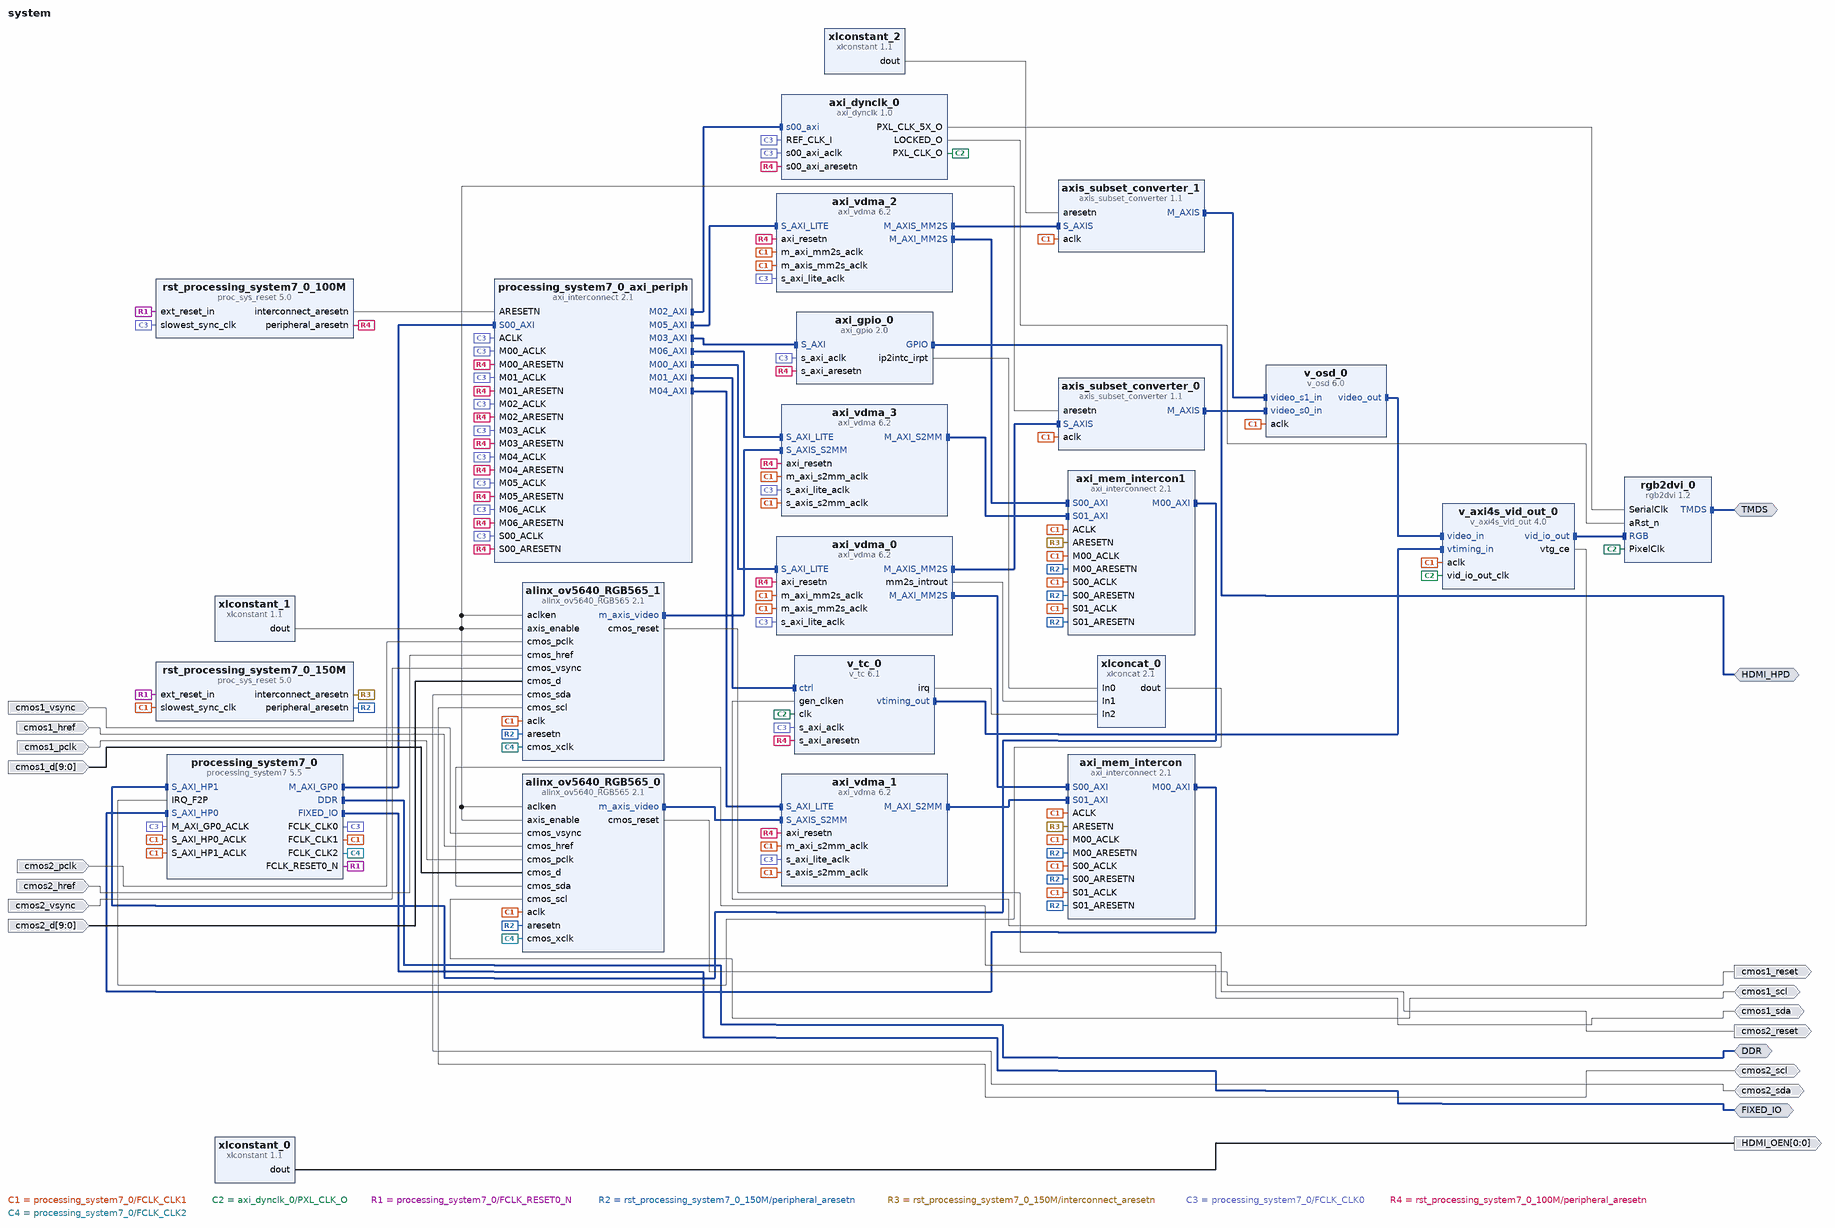
[diagram p0: block diagram of the top level]
# Vivado block design system, Vivado 2015.4
create_bd_design system

create_bd_intf_port -mode Master -vlnv digilentinc.com:interface:tmds_rtl:1.0 TMDS
create_bd_intf_port -mode Master -vlnv xilinx.com:interface:gpio_rtl:1.0 HDMI_HPD
create_bd_intf_port -mode Master -vlnv xilinx.com:interface:ddrx_rtl:1.0 DDR
create_bd_intf_port -mode Master -vlnv xilinx.com:display_processing_system7:fixedio_rtl:1.0 FIXED_IO
create_bd_port -dir O -from 0 -to 0 HDMI_OEN
create_bd_port -dir IO cmos2_sda
create_bd_port -dir IO cmos2_scl
create_bd_port -dir O cmos2_reset
create_bd_port -dir I cmos2_pclk
create_bd_port -dir I cmos2_href
create_bd_port -dir I cmos2_vsync
create_bd_port -dir I -from 9 -to 0 cmos2_d
create_bd_port -dir I cmos1_vsync
create_bd_port -dir I cmos1_href
create_bd_port -dir I cmos1_pclk
create_bd_port -dir I -from 9 -to 0 cmos1_d
create_bd_port -dir IO cmos1_sda
create_bd_port -dir IO cmos1_scl
create_bd_port -dir O cmos1_reset

create_bd_cell -type ip -vlnv digilentinc.com:ip:axi_dynclk:1.0 axi_dynclk_0
create_bd_cell -type ip -vlnv xilinx.com:ip:axi_gpio:2.0 axi_gpio_0
set_property -dict {CONFIG.C_GPIO_WIDTH 1 CONFIG.C_ALL_INPUTS 1 CONFIG.C_INTERRUPT_PRESENT 1} [get_bd_cells axi_gpio_0]
create_bd_cell -type ip -vlnv xilinx.com:ip:axi_interconnect:2.1 axi_mem_intercon
set_property -dict {CONFIG.NUM_SI 2 CONFIG.NUM_MI 1} [get_bd_cells axi_mem_intercon]
create_bd_cell -type ip -vlnv xilinx.com:ip:axi_interconnect:2.1 axi_mem_intercon1
set_property -dict {CONFIG.NUM_SI 2 CONFIG.NUM_MI 1} [get_bd_cells axi_mem_intercon1]
create_bd_cell -type ip -vlnv xilinx.com:ip:axi_vdma:6.2 axi_vdma_0
set_property -dict [list \
  CONFIG.c_num_fstores 1 \
  CONFIG.c_mm2s_genlock_mode 0 \
  CONFIG.c_mm2s_linebuffer_depth 4096 \
  CONFIG.c_mm2s_max_burst_length 128 \
  CONFIG.c_include_s2mm 0 \
  CONFIG.c_include_mm2s_dre 1 \
] [get_bd_cells axi_vdma_0]
create_bd_cell -type ip -vlnv xilinx.com:ip:axi_vdma:6.2 axi_vdma_2
set_property -dict [list \
  CONFIG.c_num_fstores 1 \
  CONFIG.c_mm2s_genlock_mode 0 \
  CONFIG.c_mm2s_linebuffer_depth 4096 \
  CONFIG.c_mm2s_max_burst_length 128 \
  CONFIG.c_include_s2mm 0 \
  CONFIG.c_include_mm2s_dre 1 \
] [get_bd_cells axi_vdma_2]
create_bd_cell -type ip -vlnv xilinx.com:ip:axi_vdma:6.2 axi_vdma_1
set_property -dict [list \
  CONFIG.c_m_axi_s2mm_data_width 64 \
  CONFIG.c_include_s2mm_dre 1 \
  CONFIG.c_num_fstores 1 \
  CONFIG.c_use_s2mm_fsync 2 \
  CONFIG.c_s2mm_genlock_mode 0 \
  CONFIG.c_s2mm_linebuffer_depth 4096 \
  CONFIG.c_include_mm2s 0 \
  CONFIG.c_s2mm_max_burst_length 128 \
] [get_bd_cells axi_vdma_1]
create_bd_cell -type ip -vlnv xilinx.com:ip:axi_vdma:6.2 axi_vdma_3
set_property -dict [list \
  CONFIG.c_m_axi_s2mm_data_width 64 \
  CONFIG.c_include_s2mm_dre 1 \
  CONFIG.c_num_fstores 1 \
  CONFIG.c_use_s2mm_fsync 2 \
  CONFIG.c_s2mm_genlock_mode 0 \
  CONFIG.c_s2mm_linebuffer_depth 4096 \
  CONFIG.c_include_mm2s 0 \
  CONFIG.c_s2mm_max_burst_length 128 \
] [get_bd_cells axi_vdma_3]
create_bd_cell -type ip -vlnv xilinx.com:ip:axis_subset_converter:1.1 axis_subset_converter_0
set_property -dict [list \
  CONFIG.S_TDATA_NUM_BYTES 4 \
  CONFIG.M_TDATA_NUM_BYTES 3 \
  CONFIG.S_TUSER_WIDTH 1 \
  CONFIG.M_TUSER_WIDTH 1 \
  CONFIG.S_HAS_TKEEP 1 \
  CONFIG.S_HAS_TLAST 1 \
  CONFIG.M_HAS_TKEEP 1 \
  CONFIG.M_HAS_TLAST 1 \
  CONFIG.TDATA_REMAP {tdata[23:16],tdata[7:0],tdata[15:8]} \
  CONFIG.TUSER_REMAP {tuser[0:0]} \
  CONFIG.TKEEP_REMAP {tkeep[2:0]} \
  CONFIG.TLAST_REMAP {tlast[0]} \
] [get_bd_cells axis_subset_converter_0]
create_bd_cell -type ip -vlnv xilinx.com:ip:axis_subset_converter:1.1 axis_subset_converter_1
set_property -dict [list \
  CONFIG.S_TDATA_NUM_BYTES 4 \
  CONFIG.M_TDATA_NUM_BYTES 3 \
  CONFIG.S_TUSER_WIDTH 1 \
  CONFIG.M_TUSER_WIDTH 1 \
  CONFIG.S_HAS_TKEEP 1 \
  CONFIG.S_HAS_TLAST 1 \
  CONFIG.M_HAS_TKEEP 1 \
  CONFIG.M_HAS_TLAST 1 \
  CONFIG.TDATA_REMAP {tdata[23:16],tdata[7:0],tdata[15:8]} \
  CONFIG.TUSER_REMAP {tuser[0:0]} \
  CONFIG.TKEEP_REMAP {tkeep[2:0]} \
  CONFIG.TLAST_REMAP {tlast[0]} \
] [get_bd_cells axis_subset_converter_1]
create_bd_cell -type ip -vlnv xilinx.com:ip:processing_system7:5.5 processing_system7_0
set_property -dict [list \
  CONFIG.PCW_APU_PERIPHERAL_FREQMHZ 767 \
  CONFIG.PCW_FPGA0_PERIPHERAL_FREQMHZ 100 \
  CONFIG.PCW_FPGA1_PERIPHERAL_FREQMHZ 150 \
  CONFIG.PCW_FPGA2_PERIPHERAL_FREQMHZ 24 \
  CONFIG.PCW_USE_S_AXI_HP0 1 \
  CONFIG.PCW_USE_S_AXI_HP1 1 \
  CONFIG.PCW_USE_FABRIC_INTERRUPT 1 \
  CONFIG.PCW_EN_CLK1_PORT 1 \
  CONFIG.PCW_EN_CLK2_PORT 1 \
  CONFIG.PCW_IRQ_F2P_INTR 1 \
  CONFIG.PCW_PRESET_BANK1_VOLTAGE {LVCMOS 1.8V} \
  CONFIG.PCW_UIPARAM_DDR_PARTNO {MT41J256M16 RE-125} \
  CONFIG.PCW_QSPI_PERIPHERAL_ENABLE 1 \
  CONFIG.PCW_QSPI_GRP_SINGLE_SS_ENABLE 1 \
  CONFIG.PCW_SD0_PERIPHERAL_ENABLE 1 \
  CONFIG.PCW_SD0_GRP_CD_ENABLE 1 \
  CONFIG.PCW_SD0_GRP_CD_IO {MIO 47} \
  CONFIG.PCW_UART1_PERIPHERAL_ENABLE 1 \
] [get_bd_cells processing_system7_0]
# 15 more settings of processing_system7_0 are not shown: defaults, MIO pin electricals, DDR timing, and values the tool derives
create_bd_cell -type ip -vlnv xilinx.com:ip:axi_interconnect:2.1 processing_system7_0_axi_periph
set_property -dict {CONFIG.NUM_MI 7} [get_bd_cells processing_system7_0_axi_periph]
create_bd_cell -type ip -vlnv digilentinc.com:ip:rgb2dvi:1.2 rgb2dvi_0
set_property -dict {CONFIG.kRstActiveHigh false CONFIG.kGenerateSerialClk false CONFIG.kClkRange 2} [get_bd_cells rgb2dvi_0]
create_bd_cell -type ip -vlnv xilinx.com:ip:proc_sys_reset:5.0 rst_processing_system7_0_100M
create_bd_cell -type ip -vlnv xilinx.com:ip:proc_sys_reset:5.0 rst_processing_system7_0_150M
create_bd_cell -type ip -vlnv xilinx.com:ip:v_axi4s_vid_out:4.0 v_axi4s_vid_out_0
set_property -dict [list \
  CONFIG.C_S_AXIS_VIDEO_FORMAT 2 \
  CONFIG.C_S_AXIS_VIDEO_DATA_WIDTH 8 \
  CONFIG.C_HAS_ASYNC_CLK 1 \
  CONFIG.C_ADDR_WIDTH 12 \
  CONFIG.C_VTG_MASTER_SLAVE 1 \
] [get_bd_cells v_axi4s_vid_out_0]
create_bd_cell -type ip -vlnv xilinx.com:ip:v_osd:6.0 v_osd_0
set_property -dict [list \
  CONFIG.HAS_AXI4_LITE false \
  CONFIG.NUMBER_OF_LAYERS 2 \
  CONFIG.SCREEN_WIDTH 1920 \
  CONFIG.S_AXIS_VIDEO_FORMAT RGB \
  CONFIG.M_AXIS_VIDEO_WIDTH 1920 \
  CONFIG.M_AXIS_VIDEO_HEIGHT 1080 \
  CONFIG.Data_Channel_Width 8 \
  CONFIG.BG_COLOR0 0 \
  CONFIG.BG_COLOR1 255 \
  CONFIG.BG_COLOR2 0 \
  CONFIG.LAYER0_ENABLE true \
  CONFIG.LAYER0_PRIORITY 0 \
  CONFIG.LAYER0_GLOBAL_ALPHA_VALUE 256 \
  CONFIG.LAYER0_HORIZONTAL_START_POSITION 0 \
  CONFIG.LAYER0_VERTICAL_START_POSITION 0 \
  CONFIG.LAYER0_WIDTH 1280 \
  CONFIG.LAYER0_HEIGHT 720 \
  CONFIG.LAYER1_ENABLE true \
  CONFIG.LAYER1_GLOBAL_ALPHA_ENABLE true \
  CONFIG.LAYER1_PRIORITY 1 \
  CONFIG.LAYER1_GLOBAL_ALPHA_VALUE 256 \
  CONFIG.LAYER1_HORIZONTAL_START_POSITION 640 \
  CONFIG.LAYER1_VERTICAL_START_POSITION 360 \
  CONFIG.LAYER1_WIDTH 1280 \
  CONFIG.LAYER1_HEIGHT 720 \
  CONFIG.LAYER2_ENABLE false \
  CONFIG.LAYER2_GLOBAL_ALPHA_ENABLE false \
  CONFIG.LAYER2_PRIORITY 1 \
  CONFIG.LAYER2_GLOBAL_ALPHA_VALUE 256 \
  CONFIG.LAYER2_HORIZONTAL_START_POSITION 0 \
  CONFIG.LAYER2_VERTICAL_START_POSITION 0 \
  CONFIG.LAYER2_WIDTH 1280 \
  CONFIG.LAYER2_HEIGHT 720 \
  CONFIG.LAYER3_ENABLE false \
  CONFIG.LAYER3_GLOBAL_ALPHA_ENABLE false \
  CONFIG.LAYER3_PRIORITY 1 \
  CONFIG.LAYER3_GLOBAL_ALPHA_VALUE 256 \
  CONFIG.LAYER3_HORIZONTAL_START_POSITION 0 \
  CONFIG.LAYER3_VERTICAL_START_POSITION 0 \
  CONFIG.LAYER3_WIDTH 1280 \
  CONFIG.LAYER3_HEIGHT 720 \
  CONFIG.LAYER4_ENABLE false \
  CONFIG.LAYER4_GLOBAL_ALPHA_ENABLE false \
  CONFIG.LAYER4_PRIORITY 1 \
  CONFIG.LAYER4_GLOBAL_ALPHA_VALUE 256 \
  CONFIG.LAYER4_HORIZONTAL_START_POSITION 0 \
  CONFIG.LAYER4_VERTICAL_START_POSITION 0 \
  CONFIG.LAYER4_WIDTH 1280 \
  CONFIG.LAYER4_HEIGHT 720 \
  CONFIG.LAYER5_ENABLE false \
  CONFIG.LAYER5_GLOBAL_ALPHA_ENABLE false \
  CONFIG.LAYER5_PRIORITY 1 \
  CONFIG.LAYER5_GLOBAL_ALPHA_VALUE 256 \
  CONFIG.LAYER5_HORIZONTAL_START_POSITION 0 \
  CONFIG.LAYER5_VERTICAL_START_POSITION 0 \
  CONFIG.LAYER5_WIDTH 1280 \
  CONFIG.LAYER5_HEIGHT 720 \
  CONFIG.LAYER6_ENABLE false \
  CONFIG.LAYER6_GLOBAL_ALPHA_ENABLE false \
  CONFIG.LAYER6_PRIORITY 1 \
  CONFIG.LAYER6_GLOBAL_ALPHA_VALUE 256 \
  CONFIG.LAYER6_HORIZONTAL_START_POSITION 0 \
  CONFIG.LAYER6_VERTICAL_START_POSITION 0 \
  CONFIG.LAYER6_WIDTH 1280 \
  CONFIG.LAYER6_HEIGHT 720 \
  CONFIG.LAYER7_ENABLE false \
  CONFIG.LAYER7_GLOBAL_ALPHA_ENABLE false \
  CONFIG.LAYER7_PRIORITY 1 \
  CONFIG.LAYER7_GLOBAL_ALPHA_VALUE 256 \
  CONFIG.LAYER7_HORIZONTAL_START_POSITION 0 \
  CONFIG.LAYER7_VERTICAL_START_POSITION 0 \
  CONFIG.LAYER7_WIDTH 1280 \
  CONFIG.LAYER7_HEIGHT 720 \
] [get_bd_cells v_osd_0]
create_bd_cell -type ip -vlnv xilinx.com:ip:v_tc:6.1 v_tc_0
set_property -dict {CONFIG.enable_detection false} [get_bd_cells v_tc_0]
create_bd_cell -type ip -vlnv xilinx.com:ip:xlconcat:2.1 xlconcat_0
set_property -dict {CONFIG.NUM_PORTS 3} [get_bd_cells xlconcat_0]
create_bd_cell -type ip -vlnv xilinx.com:ip:xlconstant:1.1 xlconstant_0
create_bd_cell -type ip -vlnv xilinx.com:ip:xlconstant:1.1 xlconstant_1
create_bd_cell -type ip -vlnv xilinx.com:ip:xlconstant:1.1 xlconstant_2
create_bd_cell -type ip -vlnv www.alinx.com.cn:user:alinx_ov5640_RGB565:2.1 alinx_ov5640_RGB565_1
create_bd_cell -type ip -vlnv www.alinx.com.cn:user:alinx_ov5640_RGB565:2.1 alinx_ov5640_RGB565_0

# ---- connections ----

connect_bd_intf_net [get_bd_intf_pins v_axi4s_vid_out_0/vid_io_out] [get_bd_intf_pins rgb2dvi_0/RGB]
connect_bd_intf_net [get_bd_intf_pins v_tc_0/vtiming_out] [get_bd_intf_pins v_axi4s_vid_out_0/vtiming_in]
connect_bd_intf_net [get_bd_intf_pins axi_vdma_0/M_AXI_MM2S] [get_bd_intf_pins axi_mem_intercon/S00_AXI]
connect_bd_intf_net [get_bd_intf_pins axi_mem_intercon/M00_AXI] [get_bd_intf_pins processing_system7_0/S_AXI_HP0]
connect_bd_intf_net [get_bd_intf_pins processing_system7_0/M_AXI_GP0] [get_bd_intf_pins processing_system7_0_axi_periph/S00_AXI]
connect_bd_intf_net [get_bd_intf_pins processing_system7_0_axi_periph/M00_AXI] [get_bd_intf_pins axi_vdma_0/S_AXI_LITE]
connect_bd_intf_net [get_bd_intf_pins processing_system7_0_axi_periph/M01_AXI] [get_bd_intf_pins v_tc_0/ctrl]
connect_bd_intf_net [get_bd_intf_pins processing_system7_0_axi_periph/M02_AXI] [get_bd_intf_pins axi_dynclk_0/s00_axi]
connect_bd_intf_net [get_bd_intf_pins processing_system7_0_axi_periph/M03_AXI] [get_bd_intf_pins axi_gpio_0/S_AXI]
connect_bd_intf_net [get_bd_intf_pins axi_vdma_0/M_AXIS_MM2S] [get_bd_intf_pins axis_subset_converter_0/S_AXIS]
connect_bd_intf_net [get_bd_intf_pins processing_system7_0_axi_periph/M04_AXI] [get_bd_intf_pins axi_vdma_1/S_AXI_LITE]
connect_bd_intf_net [get_bd_intf_pins axi_vdma_1/M_AXI_S2MM] [get_bd_intf_pins axi_mem_intercon/S01_AXI]
connect_bd_intf_net [get_bd_intf_pins v_osd_0/video_out] [get_bd_intf_pins v_axi4s_vid_out_0/video_in]
connect_bd_intf_net [get_bd_intf_pins axis_subset_converter_0/M_AXIS] [get_bd_intf_pins v_osd_0/video_s0_in]
connect_bd_intf_net [get_bd_intf_pins axi_vdma_2/M_AXIS_MM2S] [get_bd_intf_pins axis_subset_converter_1/S_AXIS]
connect_bd_intf_net [get_bd_intf_pins axis_subset_converter_1/M_AXIS] [get_bd_intf_pins v_osd_0/video_s1_in]
connect_bd_intf_net [get_bd_intf_pins axi_mem_intercon1/M00_AXI] [get_bd_intf_pins processing_system7_0/S_AXI_HP1]
connect_bd_intf_net [get_bd_intf_pins axi_mem_intercon1/S00_AXI] [get_bd_intf_pins axi_vdma_2/M_AXI_MM2S]
connect_bd_intf_net [get_bd_intf_pins processing_system7_0_axi_periph/M05_AXI] [get_bd_intf_pins axi_vdma_2/S_AXI_LITE]
connect_bd_intf_net [get_bd_intf_pins axi_mem_intercon1/S01_AXI] [get_bd_intf_pins axi_vdma_3/M_AXI_S2MM]
connect_bd_intf_net [get_bd_intf_pins processing_system7_0_axi_periph/M06_AXI] [get_bd_intf_pins axi_vdma_3/S_AXI_LITE]
connect_bd_intf_net [get_bd_intf_pins axi_vdma_3/S_AXIS_S2MM] [get_bd_intf_pins alinx_ov5640_RGB565_1/m_axis_video]
connect_bd_intf_net [get_bd_intf_pins alinx_ov5640_RGB565_0/m_axis_video] [get_bd_intf_pins axi_vdma_1/S_AXIS_S2MM]
connect_bd_intf_net [get_bd_intf_ports TMDS] [get_bd_intf_pins rgb2dvi_0/TMDS]
connect_bd_intf_net [get_bd_intf_ports HDMI_HPD] [get_bd_intf_pins axi_gpio_0/GPIO]
connect_bd_intf_net [get_bd_intf_ports DDR] [get_bd_intf_pins processing_system7_0/DDR]
connect_bd_intf_net [get_bd_intf_ports FIXED_IO] [get_bd_intf_pins processing_system7_0/FIXED_IO]
connect_bd_net [get_bd_pins xlconstant_0/dout] [get_bd_ports HDMI_OEN]
connect_bd_net [get_bd_pins processing_system7_0/FCLK_CLK1] \
  [get_bd_pins axi_vdma_0/m_axi_mm2s_aclk] [get_bd_pins axi_vdma_0/m_axis_mm2s_aclk] [get_bd_pins axi_vdma_2/m_axi_mm2s_aclk] \
  [get_bd_pins axi_vdma_2/m_axis_mm2s_aclk] [get_bd_pins axi_vdma_1/m_axi_s2mm_aclk] \
  [get_bd_pins axi_vdma_1/s_axis_s2mm_aclk] [get_bd_pins axi_vdma_3/m_axi_s2mm_aclk] \
  [get_bd_pins axi_vdma_3/s_axis_s2mm_aclk] [get_bd_pins axis_subset_converter_0/aclk] \
  [get_bd_pins axis_subset_converter_1/aclk] [get_bd_pins processing_system7_0/S_AXI_HP0_ACLK] \
  [get_bd_pins processing_system7_0/S_AXI_HP1_ACLK] [get_bd_pins rst_processing_system7_0_150M/slowest_sync_clk] \
  [get_bd_pins v_axi4s_vid_out_0/aclk] [get_bd_pins v_osd_0/aclk] [get_bd_pins alinx_ov5640_RGB565_1/aclk] \
  [get_bd_pins alinx_ov5640_RGB565_0/aclk] [get_bd_pins axi_mem_intercon/ACLK] [get_bd_pins axi_mem_intercon/S00_ACLK] \
  [get_bd_pins axi_mem_intercon/S01_ACLK] [get_bd_pins axi_mem_intercon/M00_ACLK] [get_bd_pins axi_mem_intercon1/ACLK] \
  [get_bd_pins axi_mem_intercon1/S00_ACLK] [get_bd_pins axi_mem_intercon1/S01_ACLK] [get_bd_pins axi_mem_intercon1/M00_ACLK]
connect_bd_net [get_bd_pins axi_dynclk_0/PXL_CLK_O] \
  [get_bd_pins rgb2dvi_0/PixelClk] [get_bd_pins v_axi4s_vid_out_0/vid_io_out_clk] [get_bd_pins v_tc_0/clk]
connect_bd_net [get_bd_pins axi_dynclk_0/PXL_CLK_5X_O] [get_bd_pins rgb2dvi_0/SerialClk]
connect_bd_net [get_bd_pins axi_dynclk_0/LOCKED_O] [get_bd_pins rgb2dvi_0/aRst_n]
connect_bd_net [get_bd_pins v_axi4s_vid_out_0/vtg_ce] [get_bd_pins v_tc_0/gen_clken]
connect_bd_net [get_bd_pins axi_gpio_0/ip2intc_irpt] [get_bd_pins xlconcat_0/In0]
connect_bd_net [get_bd_pins axi_vdma_0/mm2s_introut] [get_bd_pins xlconcat_0/In1]
connect_bd_net [get_bd_pins v_tc_0/irq] [get_bd_pins xlconcat_0/In2]
connect_bd_net [get_bd_pins processing_system7_0/FCLK_RESET0_N] \
  [get_bd_pins rst_processing_system7_0_100M/ext_reset_in] [get_bd_pins rst_processing_system7_0_150M/ext_reset_in]
connect_bd_net -net rst_processing_system7_0_140M_peripheral_aresetn [get_bd_pins rst_processing_system7_0_150M/peripheral_aresetn] \
  [get_bd_pins axi_mem_intercon/S00_ARESETN] [get_bd_pins axi_mem_intercon/S01_ARESETN] \
  [get_bd_pins axi_mem_intercon/M00_ARESETN] [get_bd_pins axi_mem_intercon1/S00_ARESETN] \
  [get_bd_pins axi_mem_intercon1/S01_ARESETN] [get_bd_pins axi_mem_intercon1/M00_ARESETN] \
  [get_bd_pins alinx_ov5640_RGB565_0/aresetn] [get_bd_pins alinx_ov5640_RGB565_1/aresetn]
connect_bd_net -net rst_processing_system7_0_140M_interconnect_aresetn [get_bd_pins rst_processing_system7_0_150M/interconnect_aresetn] \
  [get_bd_pins axi_mem_intercon/ARESETN] [get_bd_pins axi_mem_intercon1/ARESETN]
connect_bd_net [get_bd_pins processing_system7_0/FCLK_CLK0] \
  [get_bd_pins axi_dynclk_0/REF_CLK_I] [get_bd_pins axi_dynclk_0/s00_axi_aclk] [get_bd_pins axi_gpio_0/s_axi_aclk] \
  [get_bd_pins axi_vdma_0/s_axi_lite_aclk] [get_bd_pins axi_vdma_2/s_axi_lite_aclk] [get_bd_pins axi_vdma_1/s_axi_lite_aclk] \
  [get_bd_pins axi_vdma_3/s_axi_lite_aclk] [get_bd_pins processing_system7_0/M_AXI_GP0_ACLK] \
  [get_bd_pins rst_processing_system7_0_100M/slowest_sync_clk] [get_bd_pins v_tc_0/s_axi_aclk] \
  [get_bd_pins processing_system7_0_axi_periph/ACLK] [get_bd_pins processing_system7_0_axi_periph/S00_ACLK] \
  [get_bd_pins processing_system7_0_axi_periph/M00_ACLK] [get_bd_pins processing_system7_0_axi_periph/M01_ACLK] \
  [get_bd_pins processing_system7_0_axi_periph/M02_ACLK] [get_bd_pins processing_system7_0_axi_periph/M03_ACLK] \
  [get_bd_pins processing_system7_0_axi_periph/M04_ACLK] [get_bd_pins processing_system7_0_axi_periph/M05_ACLK] \
  [get_bd_pins processing_system7_0_axi_periph/M06_ACLK]
connect_bd_net [get_bd_pins rst_processing_system7_0_100M/peripheral_aresetn] \
  [get_bd_pins axi_dynclk_0/s00_axi_aresetn] [get_bd_pins axi_gpio_0/s_axi_aresetn] [get_bd_pins axi_vdma_0/axi_resetn] \
  [get_bd_pins axi_vdma_2/axi_resetn] [get_bd_pins axi_vdma_1/axi_resetn] [get_bd_pins axi_vdma_3/axi_resetn] \
  [get_bd_pins v_tc_0/s_axi_aresetn] [get_bd_pins processing_system7_0_axi_periph/S00_ARESETN] \
  [get_bd_pins processing_system7_0_axi_periph/M00_ARESETN] [get_bd_pins processing_system7_0_axi_periph/M01_ARESETN] \
  [get_bd_pins processing_system7_0_axi_periph/M02_ARESETN] [get_bd_pins processing_system7_0_axi_periph/M03_ARESETN] \
  [get_bd_pins processing_system7_0_axi_periph/M04_ARESETN] [get_bd_pins processing_system7_0_axi_periph/M05_ARESETN] \
  [get_bd_pins processing_system7_0_axi_periph/M06_ARESETN]
connect_bd_net [get_bd_pins rst_processing_system7_0_100M/interconnect_aresetn] [get_bd_pins processing_system7_0_axi_periph/ARESETN]
connect_bd_net [get_bd_pins xlconcat_0/dout] [get_bd_pins processing_system7_0/IRQ_F2P]
connect_bd_net [get_bd_pins xlconstant_1/dout] \
  [get_bd_pins axis_subset_converter_0/aresetn] [get_bd_pins alinx_ov5640_RGB565_1/aclken] \
  [get_bd_pins alinx_ov5640_RGB565_1/axis_enable] [get_bd_pins alinx_ov5640_RGB565_0/aclken] \
  [get_bd_pins alinx_ov5640_RGB565_0/axis_enable]
connect_bd_net [get_bd_pins xlconstant_2/dout] [get_bd_pins axis_subset_converter_1/aresetn]
connect_bd_net [get_bd_ports cmos2_sda] [get_bd_pins alinx_ov5640_RGB565_1/cmos_sda]
connect_bd_net [get_bd_ports cmos2_scl] [get_bd_pins alinx_ov5640_RGB565_1/cmos_scl]
connect_bd_net [get_bd_pins alinx_ov5640_RGB565_1/cmos_reset] [get_bd_ports cmos2_reset]
connect_bd_net -net cmos_pclk_1 [get_bd_ports cmos2_pclk] [get_bd_pins alinx_ov5640_RGB565_1/cmos_pclk]
connect_bd_net -net cmos_href_1 [get_bd_ports cmos2_href] [get_bd_pins alinx_ov5640_RGB565_1/cmos_href]
connect_bd_net -net cmos_vsync_1 [get_bd_ports cmos2_vsync] [get_bd_pins alinx_ov5640_RGB565_1/cmos_vsync]
connect_bd_net -net cmos_d_1 [get_bd_ports cmos2_d] [get_bd_pins alinx_ov5640_RGB565_1/cmos_d]
connect_bd_net [get_bd_pins processing_system7_0/FCLK_CLK2] \
  [get_bd_pins alinx_ov5640_RGB565_1/cmos_xclk] [get_bd_pins alinx_ov5640_RGB565_0/cmos_xclk]
connect_bd_net [get_bd_ports cmos1_vsync] [get_bd_pins alinx_ov5640_RGB565_0/cmos_vsync]
connect_bd_net [get_bd_ports cmos1_href] [get_bd_pins alinx_ov5640_RGB565_0/cmos_href]
connect_bd_net -net cmos_pclk_2 [get_bd_ports cmos1_pclk] [get_bd_pins alinx_ov5640_RGB565_0/cmos_pclk]
connect_bd_net -net cmos_d_2 [get_bd_ports cmos1_d] [get_bd_pins alinx_ov5640_RGB565_0/cmos_d]
connect_bd_net [get_bd_ports cmos1_sda] [get_bd_pins alinx_ov5640_RGB565_0/cmos_sda]
connect_bd_net [get_bd_ports cmos1_scl] [get_bd_pins alinx_ov5640_RGB565_0/cmos_scl]
connect_bd_net [get_bd_pins alinx_ov5640_RGB565_0/cmos_reset] [get_bd_ports cmos1_reset]

# ---- address map ----
assign_bd_address -offset 0x00000000 -range 1G -target_address_space [get_bd_addr_spaces axi_vdma_0/Data_MM2S] [get_bd_addr_segs processing_system7_0/S_AXI_HP0/HP0_DDR_LOWOCM]
assign_bd_address -offset 0x00000000 -range 1G -target_address_space [get_bd_addr_spaces axi_vdma_1/Data_S2MM] [get_bd_addr_segs processing_system7_0/S_AXI_HP0/HP0_DDR_LOWOCM]
assign_bd_address -offset 0x00000000 -range 1G -target_address_space [get_bd_addr_spaces axi_vdma_2/Data_MM2S] [get_bd_addr_segs processing_system7_0/S_AXI_HP1/HP1_DDR_LOWOCM]
assign_bd_address -offset 0x00000000 -range 1G -target_address_space [get_bd_addr_spaces axi_vdma_3/Data_S2MM] [get_bd_addr_segs processing_system7_0/S_AXI_HP1/HP1_DDR_LOWOCM]
assign_bd_address -offset 0x41200000 -range 64K -target_address_space [get_bd_addr_spaces processing_system7_0/Data] [get_bd_addr_segs axi_gpio_0/S_AXI/Reg]
assign_bd_address -offset 0x43000000 -range 64K -target_address_space [get_bd_addr_spaces processing_system7_0/Data] [get_bd_addr_segs axi_vdma_0/S_AXI_LITE/Reg]
assign_bd_address -offset 0x43010000 -range 64K -target_address_space [get_bd_addr_spaces processing_system7_0/Data] [get_bd_addr_segs axi_vdma_1/S_AXI_LITE/Reg]
assign_bd_address -offset 0x43020000 -range 64K -target_address_space [get_bd_addr_spaces processing_system7_0/Data] [get_bd_addr_segs axi_vdma_2/S_AXI_LITE/Reg]
assign_bd_address -offset 0x43030000 -range 64K -target_address_space [get_bd_addr_spaces processing_system7_0/Data] [get_bd_addr_segs axi_vdma_3/S_AXI_LITE/Reg]
assign_bd_address -offset 0x43C00000 -range 64K -target_address_space [get_bd_addr_spaces processing_system7_0/Data] [get_bd_addr_segs v_tc_0/ctrl/Reg]
assign_bd_address -offset 0x43C10000 -range 64K -target_address_space [get_bd_addr_spaces processing_system7_0/Data] [get_bd_addr_segs axi_dynclk_0/s00_axi/reg0]

validate_bd_design
save_bd_design
